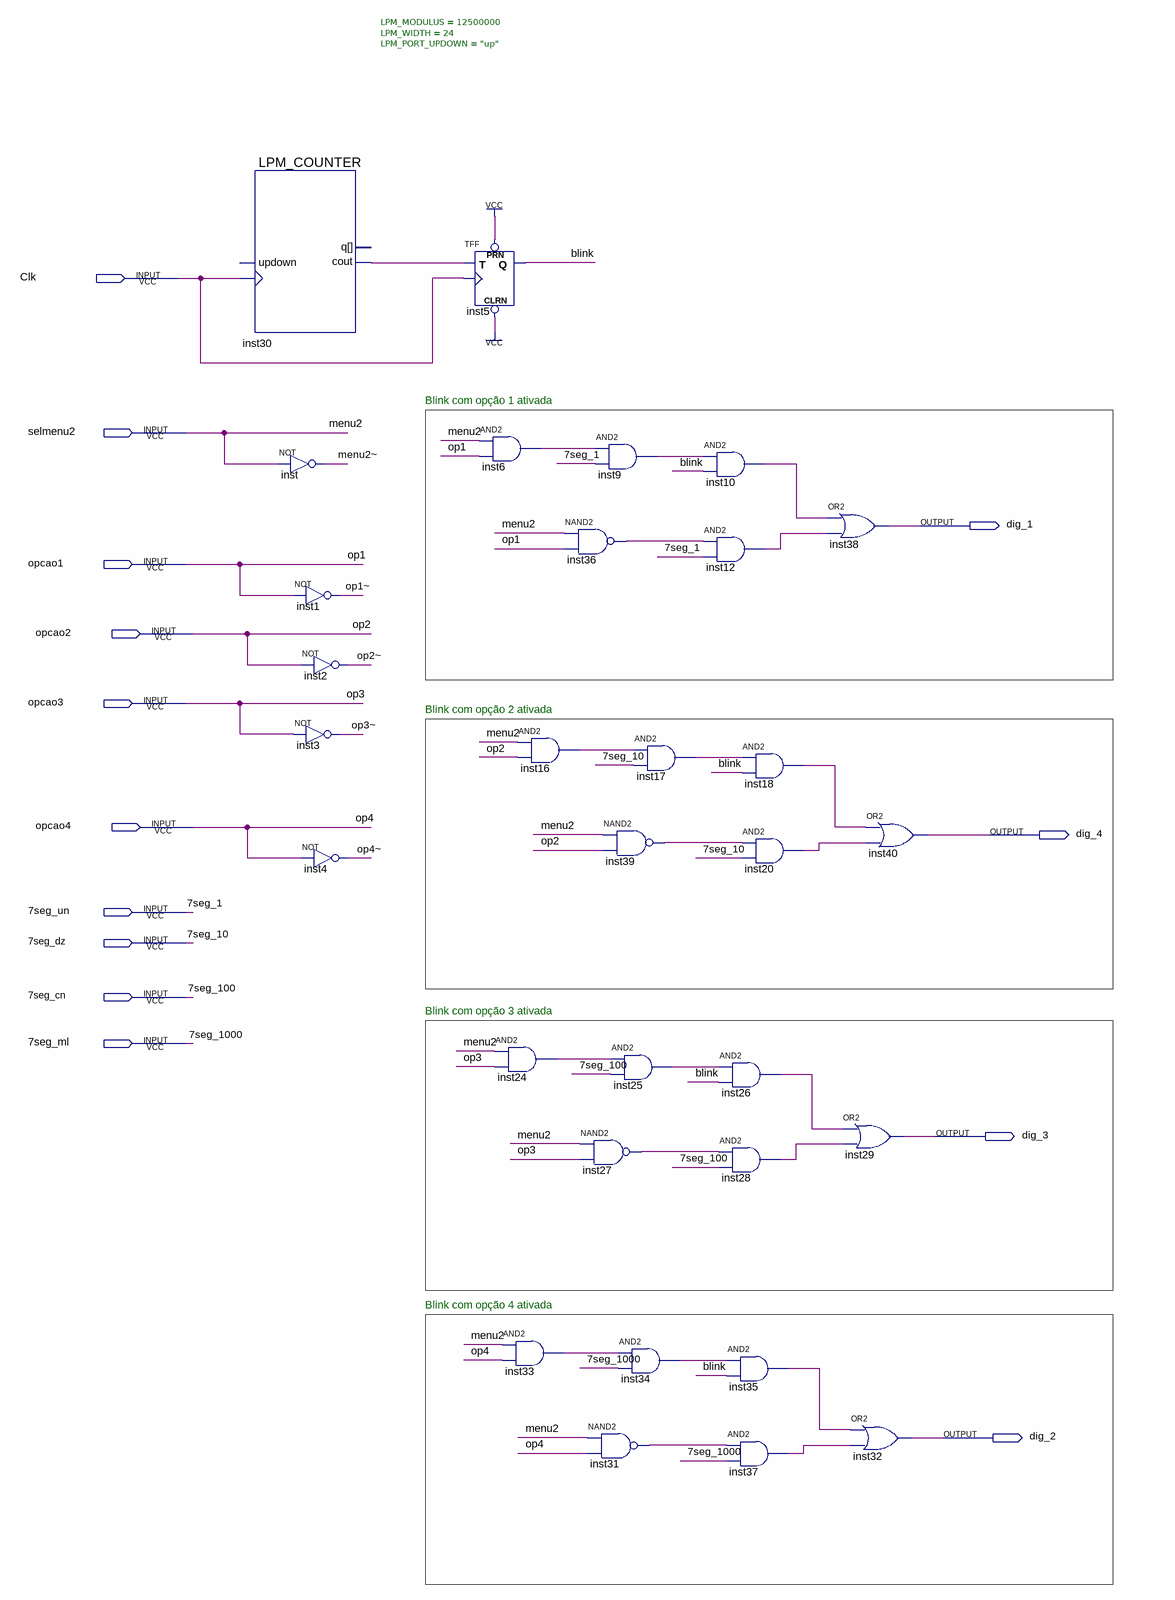
[diagram p0: schematic sheet]
// Quartus schematic Blink_antigo.bdf as structural Verilog: 31 symbols, 14 pins
module Blink_antigo (
  input  Clk,
  input  selmenu2,
  input  opcao1,
  input  opcao2,
  input  opcao3,
  input  opcao4,
  input  \7seg_un ,
  input  \7seg_dz ,
  input  \7seg_cn ,
  input  \7seg_ml ,
  output dig_1,
  output dig_4,
  output dig_3,
  output dig_2
);

  wire blink, inst6_out, inst9_out, inst10_out, inst12_out, inst16_out, inst17_out, inst18_out, inst20_out,
       inst24_out, inst25_out, inst26_out, inst27_out, inst28_out, inst30_cout, inst31_out, inst33_out,
       inst34_out, inst35_out, inst36_out, inst37_out, inst39_out, \menu2~ , \op1~ , \op2~ , \op3~ , \op4~ ;

  LPM_COUNTER #(.LPM_MODULUS(12500000), .LPM_WIDTH(24), .LPM_PORT_UPDOWN("up")) inst30 (
    .clock(Clk), .cout(inst30_cout));  // open: updown, q
  not inst (\menu2~ , selmenu2);
  not inst1 (\op1~ , opcao1);
  not inst2 (\op2~ , opcao2);
  not inst3 (\op3~ , opcao3);
  not inst4 (\op4~ , opcao4);
  TFF inst5 (.PRN(1'b1), .CLRN(1'b1), .T(inst30_cout), .CLK(Clk), .Q(blink));
  and inst6 (inst6_out, selmenu2, opcao1);
  and inst16 (inst16_out, selmenu2, opcao2);
  and inst24 (inst24_out, selmenu2, opcao3);
  and inst33 (inst33_out, selmenu2, opcao4);
  nand inst36 (inst36_out, selmenu2, opcao1);
  nand inst27 (inst27_out, selmenu2, opcao3);
  nand inst31 (inst31_out, selmenu2, opcao4);
  and inst9 (inst9_out, inst6_out, \7seg_un );
  and inst17 (inst17_out, inst16_out, \7seg_dz );
  nand inst39 (inst39_out, selmenu2, opcao2);
  and inst25 (inst25_out, inst24_out, \7seg_cn );
  and inst34 (inst34_out, inst33_out, \7seg_ml );
  and inst10 (inst10_out, inst9_out, blink);
  and inst12 (inst12_out, inst36_out, \7seg_un );
  and inst18 (inst18_out, inst17_out, blink);
  and inst20 (inst20_out, inst39_out, \7seg_dz );
  and inst26 (inst26_out, inst25_out, blink);
  and inst28 (inst28_out, inst27_out, \7seg_cn );
  and inst35 (inst35_out, inst34_out, blink);
  and inst37 (inst37_out, inst31_out, \7seg_ml );
  or inst38 (dig_1, inst10_out, inst12_out);
  or inst40 (dig_4, inst18_out, inst20_out);
  or inst29 (dig_3, inst26_out, inst28_out);
  or inst32 (dig_2, inst35_out, inst37_out);

  // Other names for the same wires on the sheet: 7seg_1 = \7seg_un ; 7seg_10 = \7seg_dz ; 7seg_100 = \7seg_cn ;
  //   7seg_1000 = \7seg_ml ; op1 = opcao1; op2 = opcao2; op3 = opcao3; op4 = opcao4; menu2 = selmenu2

  // Notes on the sheet:
  //   Blink com opção 1 ativada
  //   Blink com opção 2 ativada
  //   Blink com opção 3 ativada
  //   Blink com opção 4 ativada
endmodule
